# EAGLE design NCU_PCB_Rev2 (EAGLE 9.6.2)

## Sheet 1 of 4
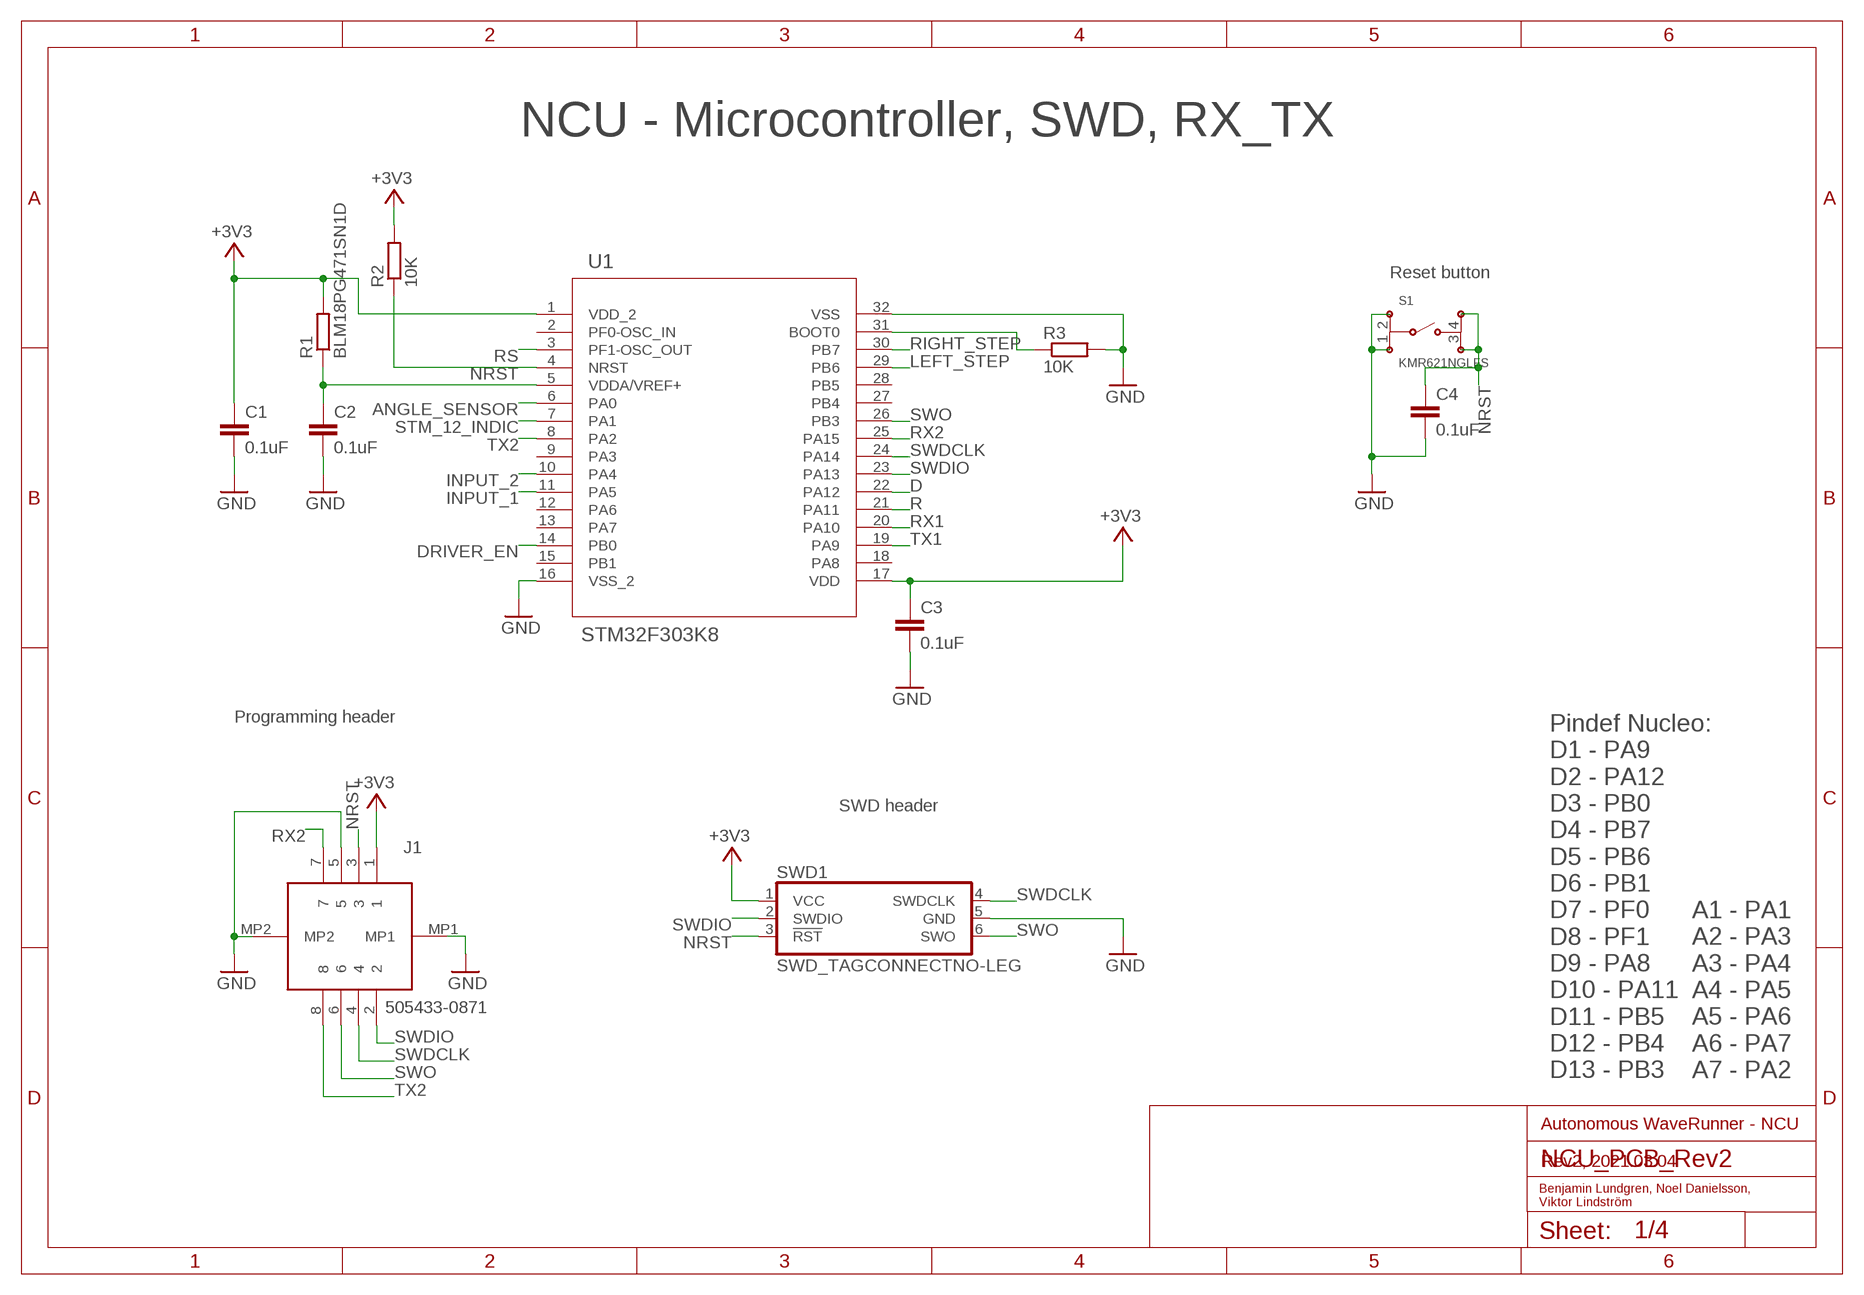
[diagram p0: schematic, sheet 1]

### Parts
C1  0.1uF  C0603  [C0603]
C2  0.1uF  C0603  [C0603]
C3  0.1uF  C0603  [C0603]
C4  0.1uF  C0603  [C0603]
J1  505433-0871  [5054330871]
R1  BLM18PG471SN1D  R0603  [R0603]
R2  10K  R0603  [R0603]
R3  10K  R0603  [R0603]
S1  KMR621NGLFS  [KMR621NGLFS]
SWD1  SWD_TAGCONNECTNO-LEG  [TC2030-IDC-NL]
U1  STM32F303K8  [LQFP-32]

### Nets
+3V3: C1.1 C3.1 J1.1 R1.2 R2.2 SWD1.1(VCC) U1.1(VDD_2) U1.17(VDD) ; also sheet 2,3,4
ANGLE_SENSOR: U1.6(PA0) ; also sheet 3
D: U1.22(PA12) ; also sheet 4
DRIVER_EN: U1.14(PB0) ; also sheet 3
GND: C1.2 C2.2 C3.2 C4.2 J1.5 J1.MP1 J1.MP2 R3.2 S1.1 S1.2 SWD1.5(GND) U1.16(VSS_2) U1.32(VSS) ; also sheet 2,3,4
INPUT_1: U1.11(PA5) ; also sheet 3
INPUT_2: U1.10(PA4) ; also sheet 3
LEFT_STEP: U1.29(PB6) ; also sheet 3
N$26: C2.1 R1.1 U1.5(VDDA/VREF+)
N$27: R3.1 U1.31(BOOT0)
NRST: C4.1 J1.3 R2.1 S1.3 S1.4 SWD1.3(!RST) U1.4(NRST)
R: U1.21(PA11) ; also sheet 4
RIGHT_STEP: U1.30(PB7) ; also sheet 3
RS: U1.3(PF1-OSC_OUT) ; also sheet 4
RX1: U1.20(PA10) ; also sheet 3
RX2: J1.7 U1.25(PA15)
STM_12_INDIC: U1.7(PA1) ; also sheet 2
SWDCLK: J1.4 SWD1.4(SWDCLK) U1.24(PA14)
SWDIO: J1.2 SWD1.2(SWDIO) U1.23(PA13)
SWO: J1.6 SWD1.6(SWO) U1.26(PB3)
TX1: U1.19(PA9) ; also sheet 3
TX2: J1.8 U1.8(PA2)
Unconnected: U1.2(PF0-OSC_IN) U1.9(PA3) U1.12(PA6) U1.13(PA7) U1.15(PB1) U1.18(PA8) U1.27(PB4) U1.28(PB5)

### Notes on the sheet
- NCU - Microcontroller, SWD, RX_TX
- Reset button
- Programming header
- SWD header
- Pindef Nucleo:
  D1 - PA9
  D2 - PA12
  D3 - PB0
  D4 - PB7
  D5 - PB6
  D6 - PB1
  D7 - PF0
  D8 - PF1
  D9 - PA8
  D10 - PA11
  D11 - PB5
  D12 - PB4
  D13 - PB3
- A1 - PA1
  A2 - PA3
  A3 - PA4
  A4 - PA5
  A5 - PA6
  A6 - PA7
  A7 - PA2
- Autonomous WaveRunner - NCU
- Rev2, 2021.03.04
- Benjamin Lundgren, Noel Danielsson, 
  Viktor Lindström

## Sheet 2 of 4
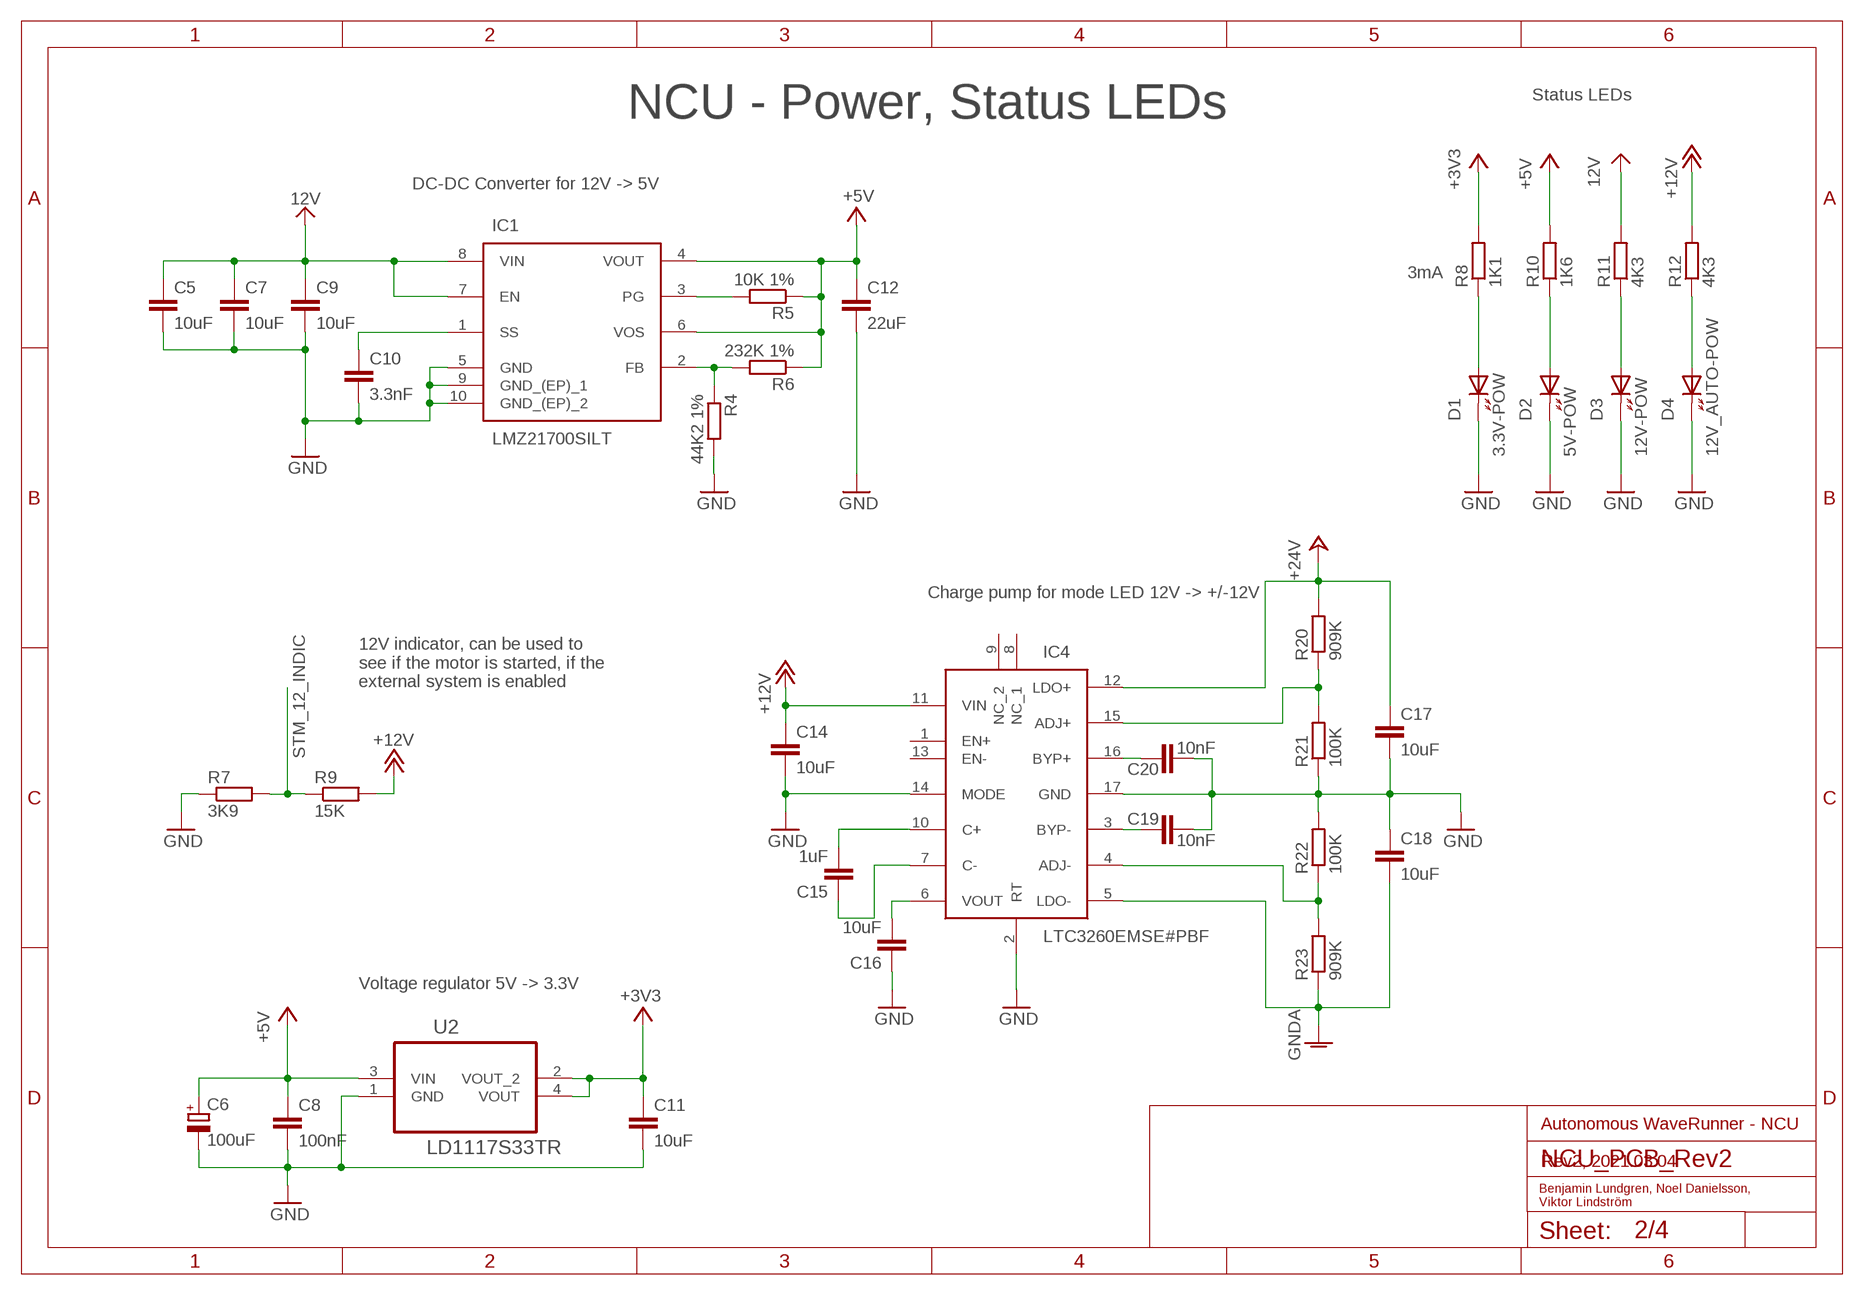
[diagram p1: schematic, sheet 2]

### Parts
C5  10uF  C1206  [C1206]
C6  100uF  PANASONIC_C  [PANASONIC_C]
C7  10uF  C1206  [C1206]
C8  100nF  C0603  [C0603]
C9  10uF  C1206  [C1206]
C10  3.3nF  C0603  [C0603]
C11  10uF  C0805  [C0805]
C12  22uF  C0805  [C0805]
C14  10uF  C1206  [C1206]
C15  1uF  C0805  [C0805]
C16  10uF  C1206  [C1206]
C17  10uF  C1206  [C1206]
C18  10uF  C1206  [C1206]
C19  10nF  C0603  [C0603]
C20  10nF  C0603  [C0603]
D1  3.3V-POW  CHIP-LED0805  [CHIP-LED0805]
D2  5V-POW  CHIP-LED0805  [CHIP-LED0805]
D3  12V-POW  CHIP-LED0805  [CHIP-LED0805]
D4  12V_AUTO-POW  CHIP-LED0805  [CHIP-LED0805]
IC1  LMZ21700SILT  [SIL0008E]
IC4  LTC3260EMSE#PBF  [SOP50P490X110-17N]
R4  44K2 1%  R0603  [R0603]
R5  10K 1%  R0603  [R0603]
R6  232K 1%  R0603  [R0603]
R7  3K9  R0603  [R0603]
R8  1K1  R0603  [R0603]
R9  15K  R0603  [R0603]
R10  1K6  R0603  [R0603]
R11  4K3  R0603  [R0603]
R12  4K3  R0603  [R0603]
R20  909K  R0603  [R0603]
R21  100K  R0603  [R0603]
R22  100K  R0603  [R0603]
R23  909K  R0603  [R0603]
U2  LD1117S33TR  [SOT230P700X180-4N]

### Nets
12V: C5.1 C7.1 C9.1 IC1.7(EN) IC1.8(VIN) R11.2 ; also sheet 3,4
+3V3: C11.1 R8.2 U2.2(VOUT_2) U2.4(VOUT) ; also sheet 1,3,4
+5V: C6.+ C8.1 C12.1 IC1.4(VOUT) IC1.6(VOS) R5.1 R6.1 R10.2 U2.3(VIN) ; also sheet 3
+12V: C14.1 IC4.11(VIN) R9.2 R12.2 ; also sheet 3,4
+24V: C17.1 IC4.12(LDO+) R20.2 ; also sheet 3
GND: C5.2 C6.- C7.2 C8.2 C9.2 C10.2 C11.2 C12.2 C14.2 C16.1 C17.2 C18.1 C19.2 C20.2 D1.C(K) D2.C(K) D3.C(K) D4.C(K) IC1.5(GND) IC1.9(GND_(EP)_1) IC1.10(GND_(EP)_2) IC4.2(RT) IC4.14(MODE) IC4.17(GND) R4.2 R7.1 R21.1 R22.2 U2.1(GND) ; also sheet 1,3,4
GNDA: C18.2 IC4.5(LDO-) R23.1 ; also sheet 3
N$4: D4.A R12.1
N$5: IC1.2(FB) R4.1 R6.2
N$6: C10.1 IC1.1(SS)
N$7: C15.2 IC4.10(C+)
N$8: C15.1 IC4.7(C-)
N$9: C20.1 IC4.16(BYP+)
N$10: D3.A R11.1
N$11: IC1.3(PG) R5.2
N$12: C19.1 IC4.3(BYP-)
N$13: C16.2 IC4.6(VOUT)
N$14: IC4.15(ADJ+) R20.1 R21.2
N$16: IC4.4(ADJ-) R22.1 R23.2
N$17: D2.A R10.1
N$42: D1.A R8.1
STM_12_INDIC: R7.2 R9.1 ; also sheet 1
Unconnected: IC4.1(EN+) IC4.8(NC_1) IC4.9(NC_2) IC4.13(EN-)

### Notes on the sheet
- NCU - Power, Status LEDs | Status LEDs
- DC-DC Converter for 12V -> 5V
- 3mA
- Charge pump for mode LED 12V -> +/-12V
- 12V indicator, can be used to
  see if the motor is started, if the 
  external system is enabled
- Voltage regulator 5V -> 3.3V
- Autonomous WaveRunner - NCU
- Rev2, 2021.03.04
- Benjamin Lundgren, Noel Danielsson, 
  Viktor Lindström

## Sheet 3 of 4
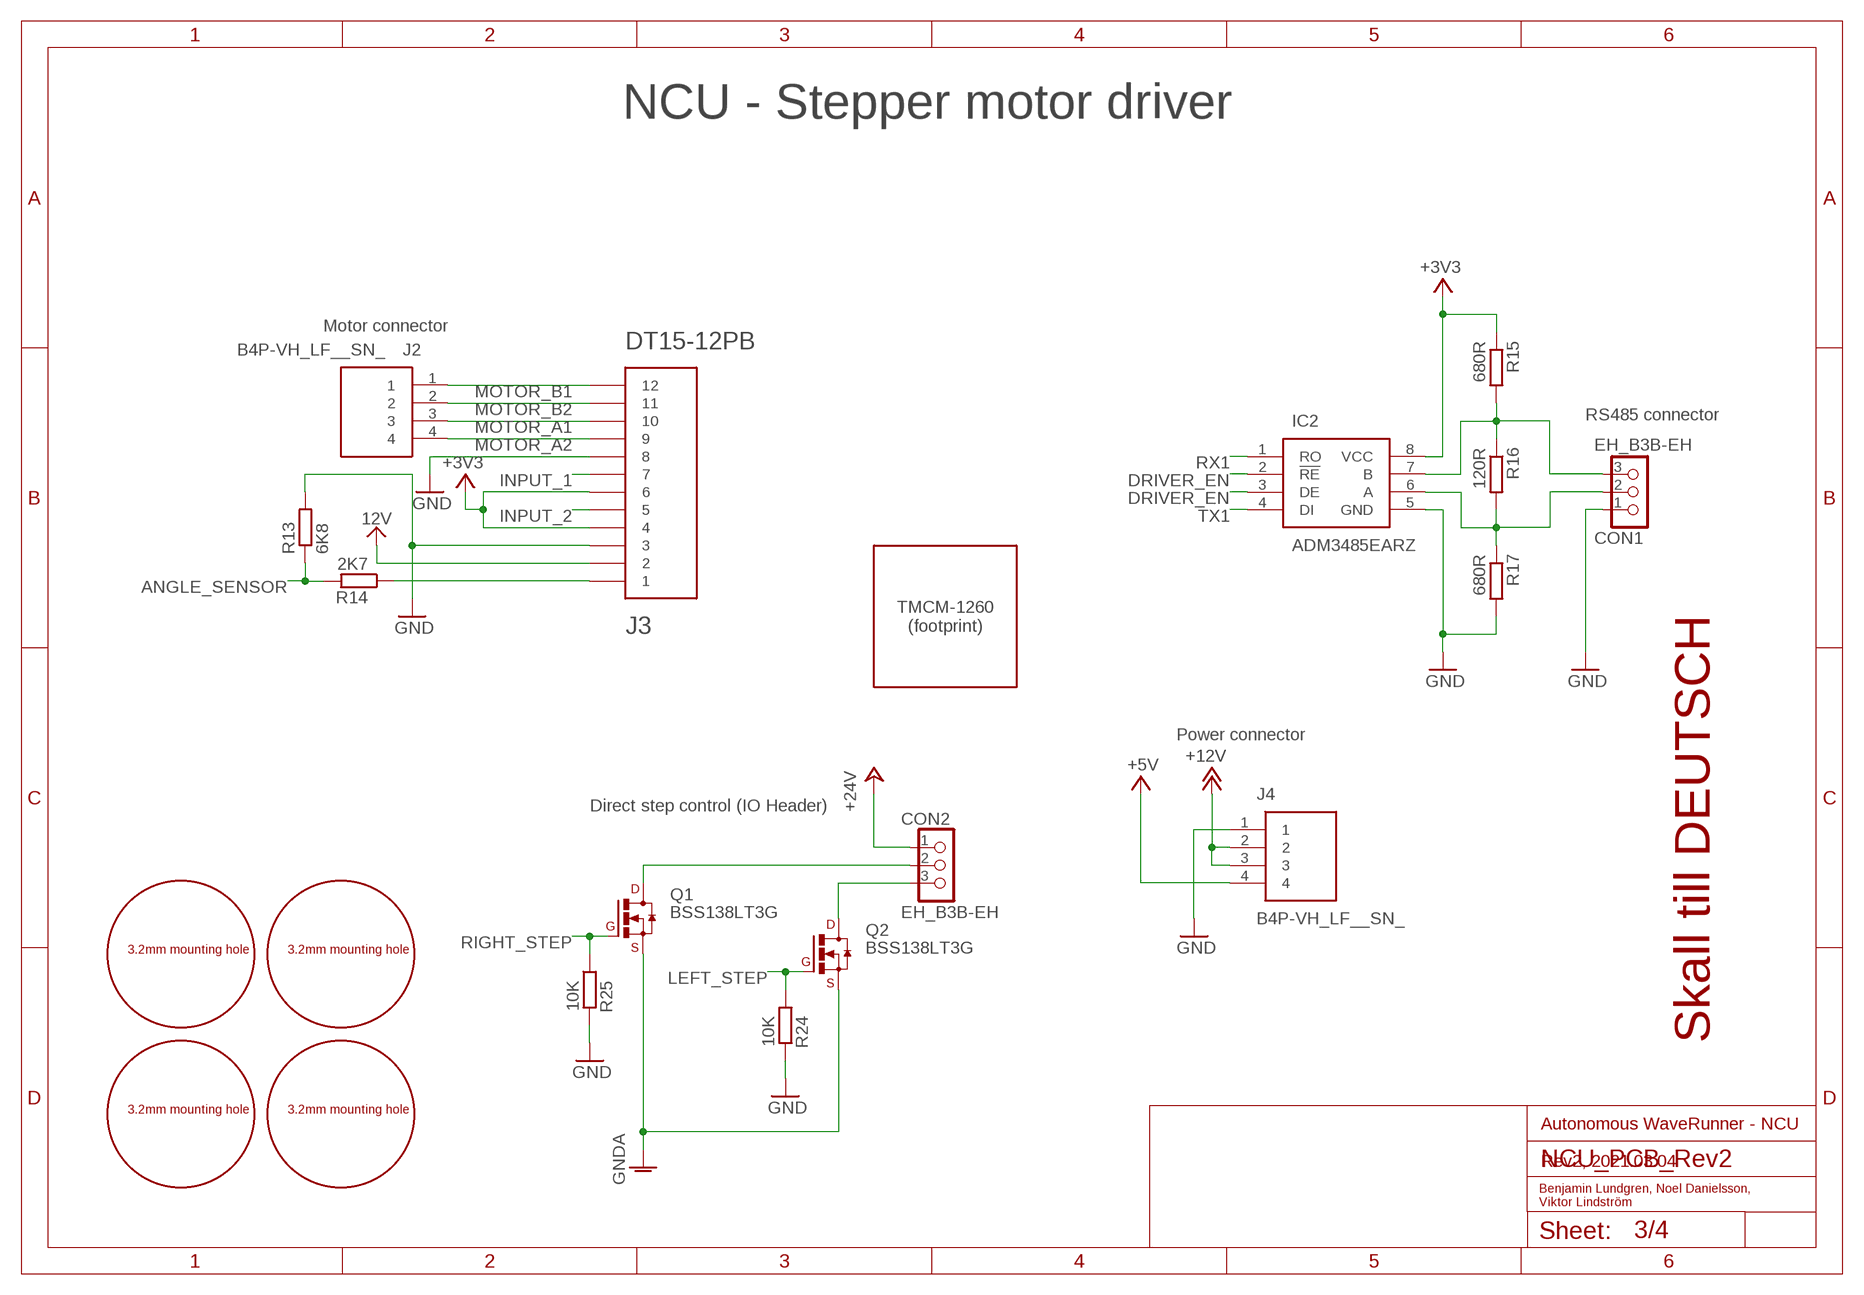
[diagram p2: schematic, sheet 3]

### Parts
CON1  EH_B3B-EH  [B3B-EH]
CON2  EH_B3B-EH  [B3B-EH]
HOLE1  M3_MOUNTING_HOLE  [M3_MOUNTING_HOLE]
HOLE2  M3_MOUNTING_HOLE  [M3_MOUNTING_HOLE]
HOLE3  M3_MOUNTING_HOLE  [M3_MOUNTING_HOLE]
HOLE4  M3_MOUNTING_HOLE  [M3_MOUNTING_HOLE]
IC2  ADM3485EARZ  [SOIC127P600X175-8N]
J2  B4P-VH_LF__SN_  [SHDR4W114P0X396_1X4_1578X850X9]
J3  DT15-12PB  [TE_DT15-12PB]
J4  B4P-VH_LF__SN_  [SHDR4W114P0X396_1X4_1578X850X9]
MOD1  TMCM-1260  [TMCM_1260]
Q1  BSS138LT3G  [SOT23]
Q2  BSS138LT3G  [SOT23]
R13  6K8  R0603  [R0603]
R14  2K7  R0603  [R0603]
R15  680R  R0603  [R0603]
R16  120R  R0603  [R0603]
R17  680R  R0603  [R0603]
R24  10K  R0603  [R0603]
R25  10K  R0603  [R0603]

### Nets
12V: J3.2 ; also sheet 2,4
+3V3: IC2.8(VCC) J3.4 J3.6 R15.1 ; also sheet 1,2,4
+5V: J4.4 ; also sheet 2
+12V: J4.2 J4.3 ; also sheet 2,4
+24V: CON2.1 ; also sheet 2
ANGLE_SENSOR: R13.1 R14.2 ; also sheet 1
DRIVER_EN: IC2.2(!RE) IC2.3(DE) ; also sheet 1
GND: CON1.1 IC2.5(GND) J3.3 J3.8 J4.1 R13.2 R17.2 R24.2 R25.2 ; also sheet 1,2,4
GNDA: Q1.2(S) Q2.2(S) ; also sheet 2
INPUT_1: J3.7 ; also sheet 1
INPUT_2: J3.5 ; also sheet 1
LEFT_STEP: Q2.1(G) R24.1 ; also sheet 1
MOTOR_A1: J2.3 J3.10
MOTOR_A2: J2.4 J3.9
MOTOR_B1: J2.1 J3.12
MOTOR_B2: J2.2 J3.11
N$1: CON1.3 IC2.7(B) R15.2 R16.1
N$2: J3.1 R14.1
N$3: CON1.2 IC2.6(A) R16.2 R17.1
N$18: CON2.2 Q1.3(D)
N$19: CON2.3 Q2.3(D)
RIGHT_STEP: Q1.1(G) R25.1 ; also sheet 1
RX1: IC2.1(RO) ; also sheet 1
TX1: IC2.4(DI) ; also sheet 1

### Notes on the sheet
- NCU - Stepper motor driver
- Motor connector
- RS485 connector
- Power connector
- Direct step control (IO Header)
- Skall till DEUTSCH
- Autonomous WaveRunner - NCU
- Rev2, 2021.03.04
- Benjamin Lundgren, Noel Danielsson, 
  Viktor Lindström

## Sheet 4 of 4
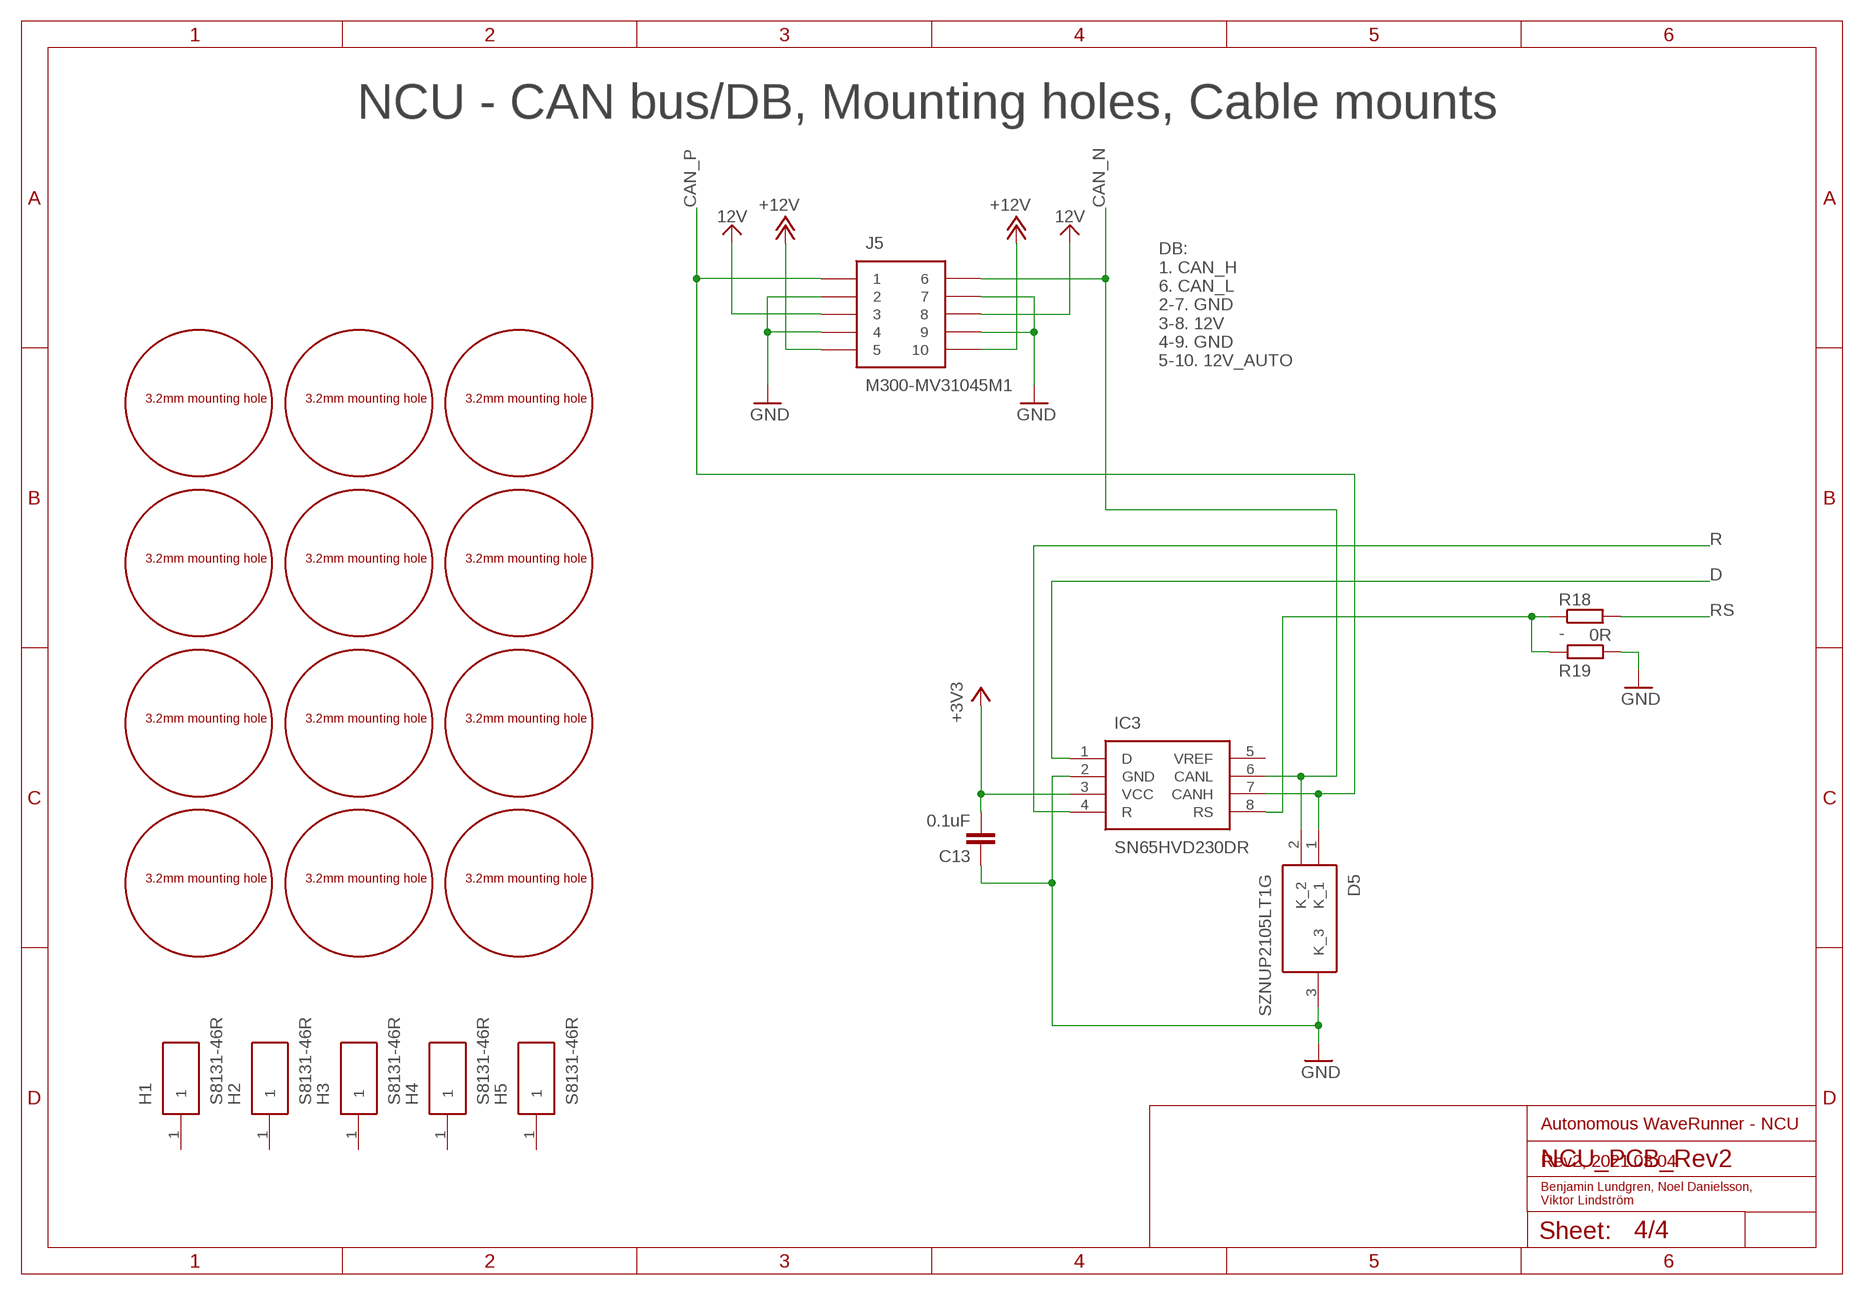
[diagram p3: schematic, sheet 4]

### Parts
C13  0.1uF  C0603  [C0603]
D5  SZNUP2105LT1G  [SOT96P237X111-3N]
H1  S8131-46R  [S813146R]
H2  S8131-46R  [S813146R]
H3  S8131-46R  [S813146R]
H4  S8131-46R  [S813146R]
H5  S8131-46R  [S813146R]
HOLE5  M3_MOUNTING_HOLE  [M3_MOUNTING_HOLE]
HOLE6  M3_MOUNTING_HOLE  [M3_MOUNTING_HOLE]
HOLE7  M3_MOUNTING_HOLE  [M3_MOUNTING_HOLE]
HOLE8  M3_MOUNTING_HOLE  [M3_MOUNTING_HOLE]
HOLE9  M3_MOUNTING_HOLE  [M3_MOUNTING_HOLE]
HOLE10  M3_MOUNTING_HOLE  [M3_MOUNTING_HOLE]
HOLE11  M3_MOUNTING_HOLE  [M3_MOUNTING_HOLE]
HOLE12  M3_MOUNTING_HOLE  [M3_MOUNTING_HOLE]
HOLE13  M3_MOUNTING_HOLE  [M3_MOUNTING_HOLE]
HOLE14  M3_MOUNTING_HOLE  [M3_MOUNTING_HOLE]
HOLE15  M3_MOUNTING_HOLE  [M3_MOUNTING_HOLE]
HOLE16  M3_MOUNTING_HOLE  [M3_MOUNTING_HOLE]
IC3  SN65HVD230DR  [SOT127P600X175-8N]
J5  M300-MV31045M1  [M300MV31045M1]
R18  -  R0603  [R0603]
R19  0R  R0603  [R0603]

### Nets
12V: J5.3 J5.8 ; also sheet 2,3
+3V3: C13.2 IC3.3(VCC) ; also sheet 1,2,3
+12V: J5.5 J5.10 ; also sheet 2,3
CAN_N: D5.2(K_2) IC3.6(CANL) J5.6
CAN_P: D5.1(K_1) IC3.7(CANH) J5.1
D: IC3.1(D) ; also sheet 1
GND: C13.1 D5.3(K_3) IC3.2(GND) J5.2 J5.4 J5.7 J5.9 R19.1 ; also sheet 1,2,3
N$15: IC3.8(RS) R18.1 R19.2
R: IC3.4(R) ; also sheet 1
RS: R18.2 ; also sheet 1
Unconnected: H1.1 H2.1 H3.1 H4.1 H5.1 IC3.5(VREF)

### Notes on the sheet
- NCU - CAN bus/DB, Mounting holes, Cable mounts
- DB:
  1. CAN_H
  6. CAN_L
  2-7. GND
  3-8. 12V
  4-9. GND
  5-10. 12V_AUTO
- Autonomous WaveRunner - NCU
- Rev2, 2021.03.04
- Benjamin Lundgren, Noel Danielsson, 
  Viktor Lindström

## Library data of the parts
C1-C4 C8 C10 C13 C19 C20 = CASE-RCL:C0603: Standard Chip CAPACITOR 0605 (1608 Metric) Description: Standard Chip CAPACITOR 0605 (1608 Metric)
C5 C7 C9 C14 C16-C18 = CASE-RCL:C1206: Standard Chip CAPACITOR 1206 (3216 Metric) Description: Standard Chip CAPACITOR 1206 (3216 Metric)
C6 = CASE-RCL:PANASONIC_C: Panasonic VS Type Aluminum Electrolytic SMD Capacitors Size C - (TEAPO D5) Description: Size C of VS type SMD capacitor from Panasonic. Diameter of cap = 5mm. (TEAPO D5) Links: TEAPO1 <http://www.farnell.com/datasheets/2622415.pdf?_ga=2.91453018.1951585514.1537363662-1535130828.1530438260> TEAPO2 <http://www.teapo.com.tw/WebSiteFile/Products/Product_Data/EV%20%20SPEC.pdf> PANASONIC <https://industrial.panasonic.com/cdbs/www-data/pdf/RDE0000/DME0000COL92.pdf>
C11 C12 C15 = CASE-RCL:C0805: Standard Chip CAPACITOR 0805 (2012 Metric) Description: Standard Chip CAPACITOR 0805 (2012 Metric)
CON1 CON2 = CASE-JST:EH_B3B-EH: JST EH Connector, through hole, 3 pin, top entry Description: JST EH connector with 2.5 mm pitch, through hole version, 3 pin, top entry. Links: Datasheet <http://www.jst-mfg.com/product/pdf/eng/eEH.pdf>
D1-D4 = CASE-LED:CHIP-LED0805: CHIP-LED0805 (SMD) Description: Standard 0805 SMD CHIP-LED
D5 = RescueRunner:SZNUP2105LT1G: Dual Bi-Directional TVS Diode, 350W peak, 3-pin SOT-23 Source: Datasheet <https://componentsearchengine.com/Datasheets/1/SZNUP2105LT1G.pdf>; DESCRIPTION: Dual Bi-Directional TVS Diode, 350W peak, 3-pin SOT-23; HEIGHT: 1.11mm; MANUFACTURER_NAME: ON Semiconductor; MANUFACTURER_PART_NUMBER: SZNUP2105LT1G; MOUSER_PART_NUMBER: 863-SZNUP2105LT1G; MOUSER_PRICE-STOCK: https://www.mouser.com/Search/Refine.aspx?Keyword=863-SZNUP2105LT1G
H1-H5 = RescueRunner:S8131-46R: HARWIN - S8131-46R - Fastener, Low Profile PCB, Surface Mount Cable Clamp, 1.8 mm, Copper, Grey, 10 mm, 8 mm Source: Datasheet <http://uk.rs-online.com/web/p/products/7884842P>; DESCRIPTION: HARWIN - S8131-46R - Fastener, Low Profile PCB, Surface Mount Cable Clamp, 1.8 mm, Copper, Grey, 10 mm, 8 mm; HEIGHT: 3.7mm; MANUFACTURER_NAME: HARWIN; MANUFACTURER_PART_NUMBER: S8131-46R; RS_PART_NUMBER: 7884842P; RS_PRICE-STOCK: http://uk.rs-online.com/web/p/products/7884842P
HOLE1-HOLE16 = RescueRunner:M3_MOUNTING_HOLE
IC1 = RescueRunner:LMZ21700SILT: 3V to 17V, 0.65A Step-Down DC/DC Power Module in 3.5mm 3.5mm Package Source: Datasheet <http://uk.rs-online.com/web/p/products/9009750P>; DESCRIPTION: 3V to 17V, 0.65A Step-Down DC/DC Power Module in 3.5mm 3.5mm Package; HEIGHT: mm; MANUFACTURER_NAME: Texas Instruments; MANUFACTURER_PART_NUMBER: LMZ21700SILT; RS_PART_NUMBER: 9009750P; RS_PRICE-STOCK: http://uk.rs-online.com/web/p/products/9009750P
IC2 = RescueRunner:ADM3485EARZ: +/-15 kV ESD-Protected, 3.3 V,12 Mbps,EIA RS-485/RS-422 Transceiver Source: Datasheet <http://uk.rs-online.com/web/p/products/0412709P>; DESCRIPTION: +/-15 kV ESD-Protected, 3.3 V,12 Mbps,EIA RS-485/RS-422 Transceiver; HEIGHT: 1.75mm; MANUFACTURER_NAME: Analog Devices; MANUFACTURER_PART_NUMBER: ADM3485EARZ; RS_PART_NUMBER: 0412709P; RS_PRICE-STOCK: http://uk.rs-online.com/web/p/products/0412709P
IC3 = RescueRunner:SN65HVD230DR: 3.3 V CAN Transceiver with Standby Mode Source: Datasheet <http://www.ti.com/lit/gpn/sn65hvd230>; DESCRIPTION: 3.3 V CAN Transceiver with Standby Mode; HEIGHT: 1.75mm; MANUFACTURER_NAME: Texas Instruments; MANUFACTURER_PART_NUMBER: SN65HVD230DR; MOUSER_PART_NUMBER: 595-SN65HVD230DR; MOUSER_PRICE-STOCK: https://www.mouser.com/Search/Refine.aspx?Keyword=595-SN65HVD230DR
IC4 = RescueRunner:LTC3260EMSE#PBF: LTC3260,Charge Pump Inverter,MSOP EP-16 Linear Technology LTC3260EMSE#PBF, Charge Pump Inverting 100mA 550 kHz, -4.5 -32 V, 16-Pin, MSOP Source: Datasheet <http://uk.rs-online.com/web/p/products/8516768P>; DESCRIPTION: LTC3260,Charge Pump Inverter,MSOP EP-16 Linear Technology LTC3260EMSE#PBF, Charge Pump Inverting 100mA 550 kHz, -4.5 -32 V, 16-Pin, MSOP; HEIGHT: 1.1mm; MANUFACTURER_NAME: Linear Technology; MANUFACTURER_PART_NUMBER: LTC3260EMSE#PBF; RS_PART_NUMBER: 8516768P; RS_PRICE-STOCK: http://uk.rs-online.com/web/p/products/8516768P
J1 = RescueRunner:505433-0871: CONN HEADER SMD 8POS 1.25MM Source: Datasheet <https://www.molex.com/pdm_docs/sd/5054330871_sd.pdf>; DESCRIPTION: CONN HEADER SMD 8POS 1.25MM; HEIGHT: 7.25mm; MANUFACTURER_NAME: Molex; MANUFACTURER_PART_NUMBER: 5054330871
J2 J4 = RescueRunner:B4P-VH_LF__SN_: connector,multipole PCB use,B4P-VH,VH se JST VH Series, 3.96mm Pitch 4 Way 1 Row Straight PCB Header, Solder Termination, 10A Source: Datasheet <http://uk.rs-online.com/web/p/products/8201157P>; DESCRIPTION: connector,multipole PCB use,B4P-VH,VH se JST VH Series, 3.96mm Pitch 4 Way 1 Row Straight PCB Header, Solder Termination, 10A; HEIGHT: 9.4mm; MANUFACTURER_NAME: JST (JAPAN SOLDERLESS TERMINALS); MANUFACTURER_PART_NUMBER: B4P-VH(LF)(SN); RS_PART_NUMBER: 8201157P; RS_PRICE-STOCK: http://uk.rs-online.com/web/p/products/8201157P
J3 = RescueRunner:DT15-12PB: DEUTSCH Automotive; DT RECP ASM; AVAILABILITY: Not in stock; DESCRIPTION: DEUTSCH Automotive; DT RECP ASM; MF: TE Connectivity; MPN: DT15-12PB; PARTREV: C3; STANDARD: Manufacturer recommendation
J5 = RescueRunner:M300-MV31045M1: Headers & Wire Housings 10 WAY MALE PC TAIL DIL WJS Source: Datasheet <https://componentsearchengine.com/Datasheets/1/M300-MV31045M1.pdf>; DESCRIPTION: Headers & Wire Housings 10 WAY MALE PC TAIL DIL WJS; HEIGHT: 7.05mm; MANUFACTURER_NAME: HARWIN; MANUFACTURER_PART_NUMBER: M300-MV31045M1
MOD1 = RescueRunner:TMCM-1260
Q1 Q2 = CASE-Transistors:BSS138LT3G: BSS138LT3G N-Channel Mosfet (SOT-23) Description: BSS138LT3G N-Channel Mosfet in a SOT-23 package Links: BSS138LT3G <http://www.farnell.com/datasheets/2353875.pdf?_ga=2.38865383.510093211.1546607516-411290609.1543318711>
R1-R25 = CASE-RCL:R0603: Standard Chip RESISTOR 0603 (1608 Metric) Description: Standard Chip RESISTOR 0603 (1608 Metric)
S1 = CASE-Switches:KMR621NGLFS: C&K KMR621NG LFS Tactile SPST switch (SMD) Description: C&K KMR621NG LFS Tactile SPST switch SMD package. Links: KMR621NG LFS <http://www.farnell.com/datasheets/2706242.pdf?_ga=2.40597409.2071720333.1546461288-1112771566.1525371275>
SWD1 = CASE-Prog_Header:SWD_TAGCONNECT: SWD Programming header (Tag-Connect version) Description: SWD Programming header for Tag Connect TC2030-IDC, both legged and no-legged version Links: Tag-Connect <http://www.tag-connect.com/JLINK>
U1 = CASE-MCU:STM32F303K8: STM32F303K8, LQFP-32 Description: STM32F303K8 from STMicroelectronics F3 series (Arm Cortex M4), LQFP-32 package Links: Datasheet <https://www.st.com/resource/en/datasheet/stm32f303k8.pdf> Website <https://www.st.com/en/microcontrollers/stm32f303k8.html> NUCLEO-F303K8 <https://www.st.com/en/evaluation-tools/nucleo-f303k8.html>; MANUFACTURER_PART_NUMBER: stm32f303_334kxt; VENDOR: STMicroelectronics
U2 = CASE-Voltage_regulators:LD1117S33TR: LD1117S33TR, 3.3V LDO voltage regulator, SOT-223-4 Description: LD1117S33TR, 3.3V LDO voltage regulator in SOT-223-3 package - Input voltage: 4.75-15V - Output voltage: 3.3V - Output current: 800mA - Dropout voltage: 1.1V Links: Datasheet <http://www.farnell.com/datasheets/1776449.pdf?_ga=2.71508627.1869469127.1547838600-114062766.1547494298>; MPN: LD1117S33TR; OC_FARNELL: 2253484; OC_NEWARK: 89K0627; PACKAGE: SOT223-3; SUPPLIER: STMicroelectronics

## Net classes
0 default: width 0.2 mm
1 motor_power: width 3.5 mm, drill 0.076 mm

## Board
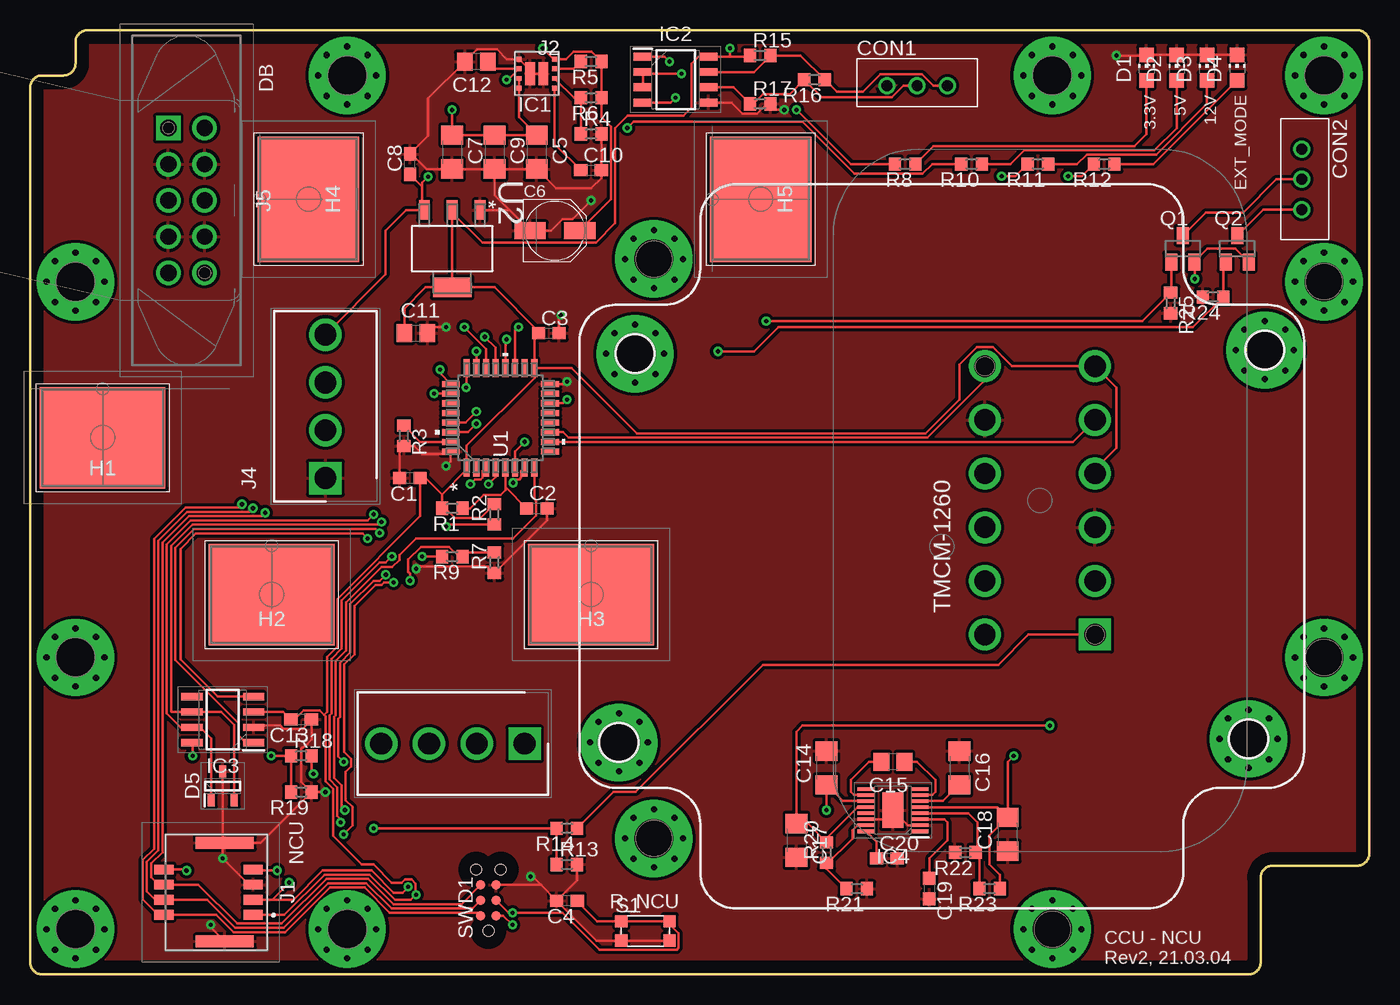
[diagram p4: board, top side]
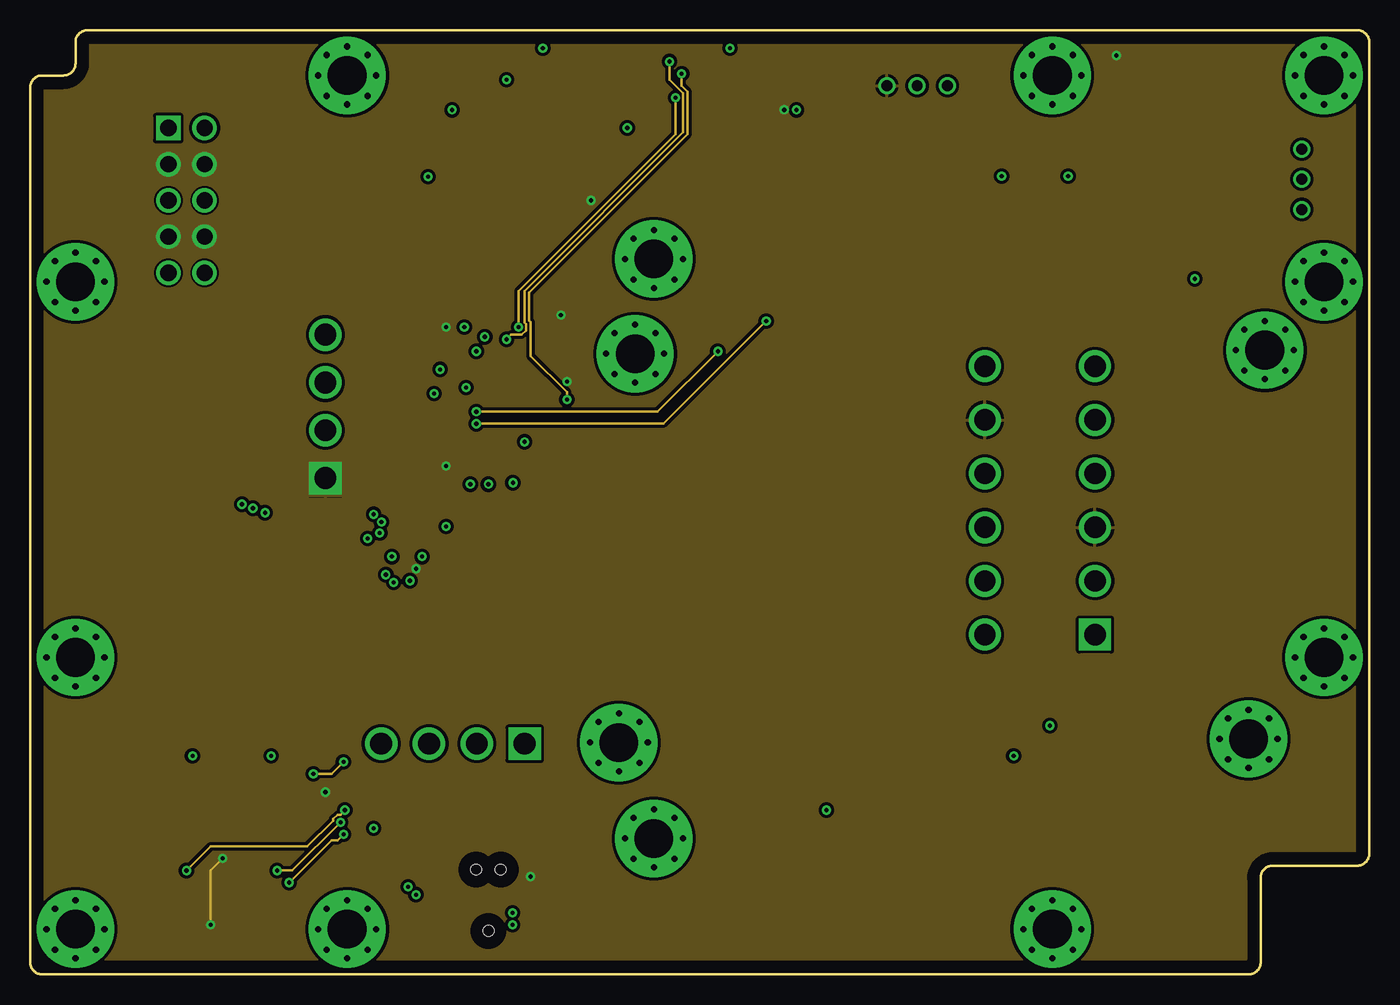
[diagram p5: board, inner layer Route2]
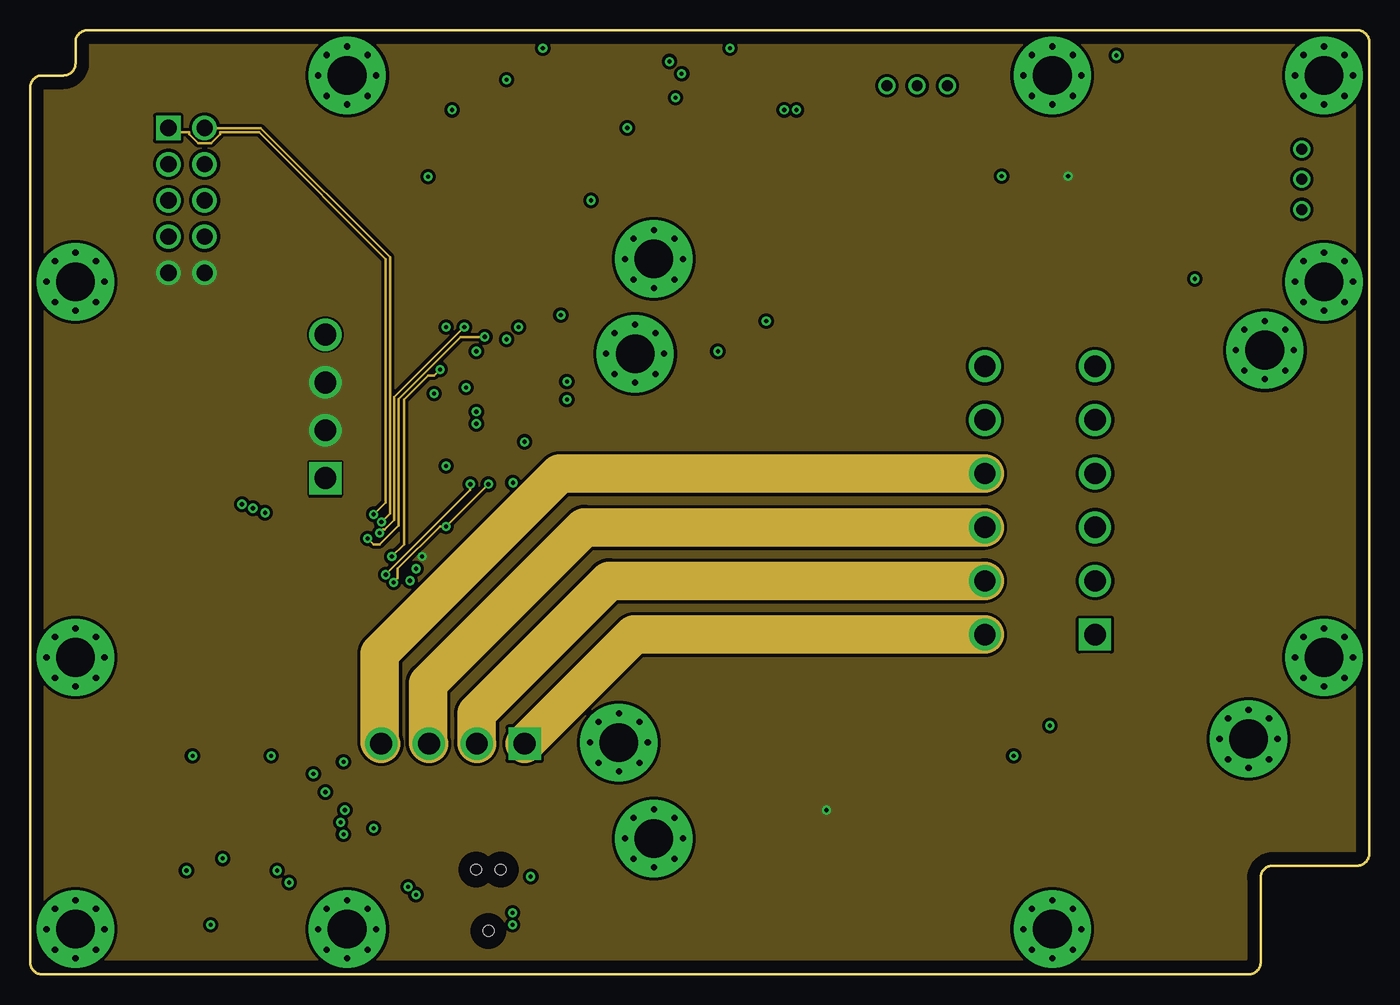
[diagram p6: board, inner layer Route15]
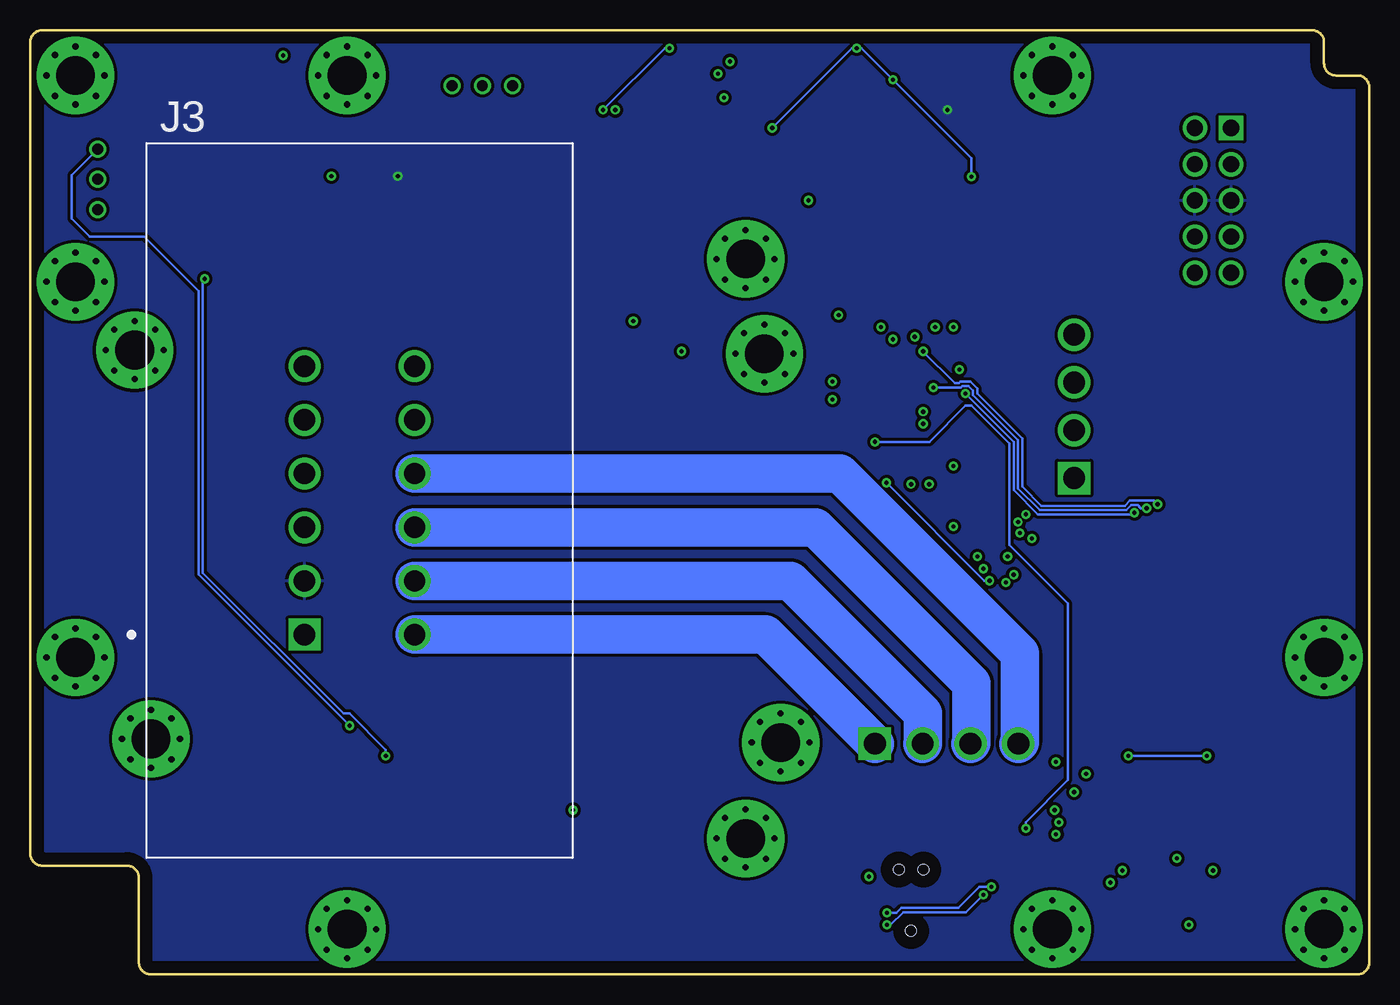
[diagram p7: board, bottom side, seen from below]

Size 110.89 x 78.2 mm. Coordinates in mm from the lower left corner, seen from the top.
Outline: 4.75,78.2 109.89,78.2 arc-90 110.89,77.2 110.89,10 arc-90 109.89,9 102.89,9 arc90 101.89,8 101.89,1 arc-90 100.89,0 1,0 arc-90 0,1 0,73.45 arc-90 1,74.45 2.75,74.45 arc90 3.75,75.45 3.75,77.2 arc-90 4.75,78.2
Copper layers (1+2*15+16): Top 0.043mm / dielectric 0.1248mm / Route2 0.035mm / dielectric 1.2mm / Route15 0.035mm / dielectric 0.1248mm / Bottom 0.043mm
Design rules "default *": minimum track width 6mil, minimum drill 0.35mm, track to track 6mil, track to pad 6mil, pad to pad 6mil, via to via 6mil, smd to smd 6mil, copper to edge 40mil, drill to drill 6mil, minimum pad ring 10mil, minimum via ring 8mil, stop-mask expansion 4mil, vias tented up to drill 0mil, thermal gap 10mil

### Footprints (pad centres in the part's own frame; a part is rotated, then mirrored left to right if it is on the bottom)
C0603 = smd 1.1 x 1: 1 -0.85,0; 2 0.85,0
C1206 = smd 1.6 x 1.8: 1 -1.4,0; 2 1.4,0
PANASONIC_C = smd 2.6 x 1.4: + 2.05,0; - -2.05,0
C0805 = smd 1.3 x 1.5: 1 -0.95,0; 2 0.95,0
B3B-EH = drill 0.9: 1 -2.5,0; 2 0,0; 3 2.5,0
CHIP-LED0805 = smd 1.2 x 1.2: A 0,-1.05; C 0,1.05
SOT96P237X111-3N = smd 1 x 0.6: 1 -1.2,0.955; 2 -1.2,-0.955; 3 1.2,0
S813146R = smd 10.4 x 8.4: 1 0,0
M3_MOUNTING_HOLE = drill 0.5 pad 0.8: P$1 -2.4,0; P$2 0,2.4; P$3 2.4,0; P$4 0,-2.4; P$5 -1.697,1.697; P$6 1.697,1.697; P$7 1.697,-1.697; P$8 -1.697,-1.697 | drill 3.2 pad 6.4: P$10 0,0
SIL0008E = smd 0.45 x 0.4: 1 -1.475,1.2; 2 -1.475,0.4; 3 -1.475,-0.4; 4 -1.475,-1.2; 5 1.475,-1.2; 6 1.475,-0.4; 7 1.475,0.4; 8 1.475,1.2 | smd 0.8 x 1.9: 9 0.55,0; 10 -0.55,0
SOIC127P600X175-8N = smd 1.525 x 0.65: 1 -2.712,1.905; 2 -2.712,0.635; 3 -2.712,-0.635; 4 -2.712,-1.905; 5 2.712,-1.905; 6 2.712,-0.635; 7 2.712,0.635; 8 2.712,1.905
SOT127P600X175-8N = smd 1.75 x 0.6: 1 -2.55,1.905; 2 -2.55,0.635; 3 -2.55,-0.635; 4 -2.55,-1.905; 5 2.55,-1.905; 6 2.55,-0.635; 7 2.55,0.635; 8 2.55,1.905
SOP50P490X110-17N = smd 1.425 x 0.3: 1 -2.212,1.75; 2 -2.212,1.25; 3 -2.212,0.75; 4 -2.212,0.25; 5 -2.212,-0.25; 6 -2.212,-0.75; 7 -2.212,-1.25; 8 -2.212,-1.75; 9 2.212,-1.75; 10 2.212,-1.25; 11 2.212,-0.75; 12 2.212,-0.25; 13 2.212,0.25; 14 2.212,0.75; 15 2.212,1.25; 16 2.212,1.75 | smd 1.753 x 2.947: 17 0,0
5054330871 = smd 0.8 x 1.6: 1 1.875,3.517; 2 1.875,-3.873; 3 0.625,3.517; 4 0.625,-3.873; 5 -0.625,3.517; 6 -0.625,-3.873; 7 -1.875,3.517; 8 -1.875,-3.873 | smd 1 x 4.8: MP1 4.075,1.177; MP2 -4.075,1.177
SHDR4W114P0X396_1X4_1578X850X9 = drill 1.8 pad 2.7 square: 1 0,0 | drill 1.8 pad 2.7: 2 3.96,0; 3 7.92,0; 4 11.88,0
TE_DT15-12PB = drill 1.77 square: 1 -4.56,-11.115 | drill 1.77: 2 -4.56,-6.67; 3 -4.56,-2.225; 4 -4.56,2.225; 5 -4.56,6.67; 6 -4.56,11.115; 7 4.56,11.115; 8 4.56,6.67; 9 4.56,2.225; 10 4.56,-2.225; 11 4.56,-6.67; 12 4.56,-11.115
M300MV31045M1 = drill 1.35 pad 2.025 square: 1 0,0 | drill 1.35 pad 2.025: 2 3,0; 3 6,0; 4 9,0; 5 12,0; 6 0,3; 7 3,3; 8 6,3; 9 9,3; 10 12,3
SOT23 = smd 1 x 1.4: 1 -0.95,-1.1; 2 0.95,-1.1; 3 0,1.1
R0603 = smd 1 x 1.1: 1 -0.85,0; 2 0.85,0
KMR621NGLFS = smd 1 x 1: 1 -2,-0.8; 2 2,-0.8; 3 -2,0.8; 4 2,0.8
TC2030-IDC-NL = smd 0.787 x 0.787: 1 1.27,-0.635; 2 1.27,0.635; 3 2.54,-0.635; 4 2.54,0.635; 5 3.81,-0.635; 6 3.81,0.635 | hole 0.889: 0,0; 5.08,-1.016; 5.08,1.016
LQFP-32 = smd 1.473 x 0.508: 1 -4.115,2.8; 2 -4.115,2; 3 -4.115,1.2; 4 -4.115,0.4; 5 -4.115,-0.4; 6 -4.115,-1.2; 7 -4.115,-2; 8 -4.115,-2.8; 17 4.115,-2.8; 18 4.115,-2; 19 4.115,-1.2; 20 4.115,-0.4; 21 4.115,0.4; 22 4.115,1.2; 23 4.115,2; 24 4.115,2.8 | smd 0.508 x 1.473: 9 -2.8,-4.115; 10 -2,-4.115; 11 -1.2,-4.115; 12 -0.4,-4.115; 13 0.4,-4.115; 14 1.2,-4.115; 15 2,-4.115; 16 2.8,-4.115; 25 2.8,4.115; 26 2,4.115; 27 1.2,4.115; 28 0.4,4.115; 29 -0.4,4.115; 30 -1.2,4.115; 31 -2,4.115; 32 -2.8,4.115
SOT230P700X180-4N = smd 1.626 x 0.889: 1 -3.2,2.311; 2 -3.2,0; 3 -3.2,-2.311 | smd 1.626 x 3.175: 4 3.2,0

### Placement (x,y rotation side)
C1  31.45,41.1 180 top
C2  41.95,38.6 0 top
C3  42.95,53.1 0 top
C4  44.45,6.1 180 top
C5  41.95,68.1 270 top
C6  43.45,61.6 0 top
C7  34.95,68.1 270 top
C8  31.45,67.1 90 top
C9  38.45,68.1 270 top
C10  46.45,66.6 0 top
C11  31.95,53.1 0 top
C12  36.95,75.6 180 top
C13  22.45,21.1 180 top
C14  65.95,17.1 90 top
C15  71.45,17.6 180 top
C16  76.95,17.1 270 top
C17  63.45,11.1 270 top
C18  80.95,11.6 90 top
C19  74.45,7.1 270 top
C20  70.95,9.6 0 top
CON1  73.45,73.6 0 top
CON2  105.3,65.85 270 top
D1  92.45,75.1 0 top
D2  94.95,75.1 0 top
D3  97.45,75.1 0 top
D4  99.95,75.1 0 top
D5  15.95,15.6 90 top
H1  6,44.45 0 top
H2  20,31.45 0 top
H3  46.45,31.45 0 top
H4  23.05,64.2 90 top
H5  60.5,64.2 90 top
HOLE1  102.24,51.7 0 top
HOLE2  50.09,51.4 0 top
HOLE3  100.89,19.5 0 top
HOLE4  48.74,19.2 0 top
HOLE5  26.25,74.45 0 top
HOLE6  107.14,57.36 0 top
HOLE7  3.75,3.75 0 top
HOLE8  3.75,26.25 0 top
HOLE9  84.64,74.45 0 top
HOLE10  107.14,74.45 0 top
HOLE11  107.14,26.25 0 top
HOLE12  3.75,57.36 0 top
HOLE13  51.64,11.25 0 top
HOLE14  51.64,59.25 0 top
HOLE15  84.64,3.75 0 top
HOLE16  26.25,3.75 0 top
IC1  41.95,74.6 180 top
IC2  53.45,74.1 0 top
IC3  15.95,21.1 180 top
IC4  71.45,13.6 180 top
J1  14.95,6.8 270 top
J2  40.95,19.1 180 top
J3  83.62,39.25 0 bottom
J4  24.45,41.1 90 top
J5  11.45,70.1 270 top
MOD1  75.49,35.45 90 top
Q1  95.45,60.1 0 top
Q2  99.95,60.1 0 top
R1  34.95,38.6 180 top
R2  38.45,38.1 90 top
R3  30.95,44.6 270 top
R4  46.45,69.6 0 top
R5  46.45,75.6 180 top
R6  46.45,72.6 180 top
R7  38.45,34.1 90 top
R8  72.45,67.1 180 top
R9  34.95,34.6 180 top
R10  77.95,67.1 180 top
R11  83.45,67.1 180 top
R12  88.95,67.1 180 top
R13  44.45,9.1 0 top
R14  44.45,12.1 180 top
R15  60.45,76.1 0 top
R16  64.95,74.1 180 top
R17  60.45,72.1 0 top
R18  22.45,18.1 0 top
R19  22.45,15.1 180 top
R20  65.95,10.1 90 top
R21  68.45,7.1 180 top
R22  77.45,10.1 180 top
R23  79.45,7.1 180 top
R24  97.95,56.1 180 top
R25  94.45,55.6 270 top
S1  50.95,3.6 0 top
SWD1  37.95,3.6 90 top
U1  38.95,46.1 90 top
U2  34.95,60.1 270 top

### Tracks (layer width: path | path; a pad name or v marks a point on that pad's centre or on a via)
12V  (via drill 0.35)
  Top 0.2: IC1.7 IC1.8 40.47,70.97 C5.1 C9.1 C7.1 v34.95,71.6 | R11.2 81.6,66.1 v80.45,66.1
  pour Bottom (isolate 0.254): -1.05,78.6 111.45,78.6 111.45,-0.4 -1.05,-0.4
+3V3  (via drill 0.35)
  Top 0.2: J1.1 21.05,4.93 24.38,8.26 28.12,8.26 30.22,6.16 31.5,6.16 v31.95,6.6 31.93,6.61 31.93,7.5 31.57,7.87 31.04,7.87 30.77,7.6 29.95,7.6 28.45,9.1 27.45,9.1 25.08,11.47 25.08,15.36 24.45,15.99 24.45,21.36 24.32,21.48 | IC3.3 20.96,21.73 C13.2 21.89,21.1 22.64,21.85 23.95,21.85 24.32,21.48 | C11.1 31,55.05 30.95,55.1 32.75,56.9 U2.4 | R15.1 59.5,76 57.95,76 | 57.95,76 IC2.8 55.35,76 54.75,75.4 54.75,71.76 54.08,71.1 49.45,71.1 48.45,70.1 48.45,62.2 46.85,60.6 37.45,60.6 34.95,63.1 | v63.45,71.6 67.95,67.1 R8.2 | v57.95,76.7 57.95,76 | U2.4 38.45,56.9 42.1,53.25 C3.1 41.75,52.75 U1.17 | 34.1,39.75 R1.2 34.39,38.6 35.19,37.8 37.29,37.8 R2.2 | 34.1,39.75 36.15,41.8 U1.1 36.15,43.8 41.75,49.4 U1.17 | 34.1,39.75 32.75,41.1 C1.1 32.3,37.95 25.45,31.1 25.45,27.15 24.59,26.29 24.59,21.75 24.32,21.48 | U2.2 34.95,63.1 | 34.95,63.1 U2.4 | U1.17 44.83,50.21 50.24,44.8 74.15,44.8 76.95,47.6 76.95,50.49 78.4,51.95 79.71,51.95 81.29,50.37 J3.6 89.95,48.6 89.95,43.6 88.18,41.83 J3.4 | SWD1.1 39.18,4.87 v39.95,4.1
  Bottom 0.2: v31.95,6.6 33.39,5.16 38.59,5.16 39.65,4.1 v39.95,4.1 | v63.45,71.6 58.34,76.7 v57.95,76.7
+5V  (via drill 0.35)
  Top 0.2: J4.4 29.45,57.98 29.45,61.6 31.15,63.3 32.45,63.3 | 32.45,63.3 U2.3 | C8.1 32.45,65.25 | 32.45,65.25 32.45,63.3 | C12.1 38.5,75 IC1.6 39.57,74.1 v39.45,74.1 | v42.45,76.7 43.35,75.8 IC1.4 44.39,75.8 44.99,76.4 46.49,76.4 R5.1 R6.1 47.3,71.01 48.1,70.2 48.1,64.2 C6.+ | v32.95,66.07 32.45,65.57 32.45,65.25 | R10.2 74.7,67.1 73.9,66.3 68.25,66.3 63.95,70.6 49.95,70.6 v49.45,70.1
  Bottom 0.2: v32.95,66.07 32.95,67.6 v39.45,74.1 42.05,76.7 v42.45,76.7 42.84,76.7 v49.45,70.1
+12V  (via drill 0.35)
  Top 0.2: R9.2 v32.45,34.6 | R12.2 87.1,66.1 v85.95,66.1 | IC4.11 67.3,14.35 C14.1 v65.95,13.6
  pour Route15 (isolate 0.254, rank 2): -1.05,78.6 111.45,78.6 111.45,-0.4 -1.05,-0.4
  pour Route15 (no thermals): 20.45,54.6 20.45,39.6 28.45,39.6 28.45,54.6
  pour Route15 (no thermals): 8.95,59.6 16.95,59.6 16.95,56.6 8.95,56.6
+24V  (via drill 0.35)
  Top 0.2: IC4.12 68.52,13.85 65.95,11.28 R20.2 64.4,12.5 C17.1 63.45,20.1 63.95,20.6 v84.45,20.6
  Bottom 0.2: v84.45,20.6 96.95,33.1 96.95,56.6 101.45,61.1 105.95,61.1 107.45,62.6 107.45,66.2 CON2.1
ANGLE_SENSOR  (via drill 0.35)
  Top 0.2: R13.1 R14.2 v28.45,12.1 | U1.6 40.15,43.3 v40.95,44.1
  Bottom 0.2: v40.95,44.1 36.45,44.1 33.45,47.1 32.95,47.1 29.8,43.95 29.8,35.56 24.95,30.71 24.95,16.1 28.45,12.6 v28.45,12.1
CAN_N  (via drill 0.35)
  Top 0.2: v29.09,37.46 28.88,37.25 13.45,37.25 11.67,35.47 11.67,21.77 11.71,21.73 IC3.6 15.81,21.73 16.9,20.64 D5.2
  Route15 0.2: J5.6 19.09,70.1 29.8,59.39 29.8,38.17 v29.09,37.46
CAN_P  (via drill 0.35)
  Top 0.2: v28.45,38.1 27.95,37.6 13.3,37.6 11.31,35.61 11.31,21.63 12.48,20.46 IC3.7 14.08,20.46 14.99,19.55 D5.1
  Route15 0.2: J5.1 11.8,69.75 13.18,69.75 13.18,69.57 13.92,68.83 14.97,68.83 15.71,69.57 15.71,69.75 18.95,69.75 29.45,59.25 29.45,39.1 v28.45,38.1
D  (via drill 0.35)
  Top 0.2: IC3.1 18.04,19.19 17.95,19.1 17.25,19.79 17.25,20.79 12.02,26.03 12.02,35.32 13.59,36.89 28.6,36.89 v28.95,36.55 | v35.95,53.6 37.75,51.8 U1.22
  Route15 0.2: v28.95,36.55 29.22,36.83 29.35,36.83 30.15,37.63 30.15,47.8 v35.95,53.6
DRIVER_EN  (via drill 0.35)
  Top 0.2: IC2.2 50.73,74.6 | 50.73,74.6 IC2.3 | U1.14 44.15,47.3 v44.45,47.6 | v53.95,74.6 50.73,74.6
  Route2 0.2: v44.45,47.6 44.45,48.21 41.43,51.22 41.43,54.01 41.3,54.14 41.3,56.45 54.44,69.6 54.45,69.6 54.45,73.1 53.95,73.6 v53.95,74.6
GND  (via drill 0.35)
  Top 0.2: D4.C D3.C D2.C D1.C 92.4,76.1 v89.95,76.1 | C4.2 46.9,2.8 S1.1 S1.2 | R13.2 45.3,7.8 C4.2 | SWD1.5 42.29,7.41 | 42.29,7.41 C4.2 | IC3.2 18.63,20.6 20.69,20.6 20.94,20.35 22.54,20.35 C13.1 23.3,19.45 22.75,18.9 22.69,18.9 22.45,18.66 22.45,15.95 R19.1 | D5.3 15.95,11.06 J1.MP2 | R19.1 19.08,10.88 J1.MP2 | J1.MP1 14.95,3.91 v14.95,4.1 | J1.MP2 15.95,10.7 v15.95,9.6 18.12,7.43 J1.5 | 42.29,7.41 41.6,8.1 v41.45,8.1 | IC2.5 58.09,72.19 58.99,71.3 60.2,71.3 61,72.1 R17.2 61.8,71.6 v62.45,71.6 | C9.2 C5.2 43.55,65.1 46.45,65.1 47.3,65.95 C10.2 R4.2 | C8.2 31.52,68.02 | 31.52,68.02 32.95,69.45 32.95,72.55 C12.2 37,76.6 38.65,76.6 39.45,75.8 IC1.5 41.4,74.87 IC1.9 IC1.10 | 31.52,68.02 32.85,66.7 C7.2 C9.2 | C2.2 42.8,37.6 R7.1 37.9,33.8 32.14,33.8 v31.95,33.6 | C1.2 30.6,43.4 R3.2 31.8,43.75 32.45,43.1 34.63,43.1 U1.32 34.83,42.48 v34.45,42.1 | 39.7,63.3 C6.- 43.14,61.6 44.09,62.55 44.9,62.55 v46.45,64.1 | 39.7,63.3 U2.1 | C9.2 38.45,64.55 39.7,63.3 | R19.1 v24.45,15.1 | C3.2 43.8,54.45 v43.95,54.6 | U1.16 44.25,48.9 v44.45,49.1 | C11.2 33.4,53.6 v34.45,53.6 | IC4.2 72.7,12.35 IC4.17 71.2,13.35 70.7,12.85 IC4.14
  Route2 0.2: v14.95,4.1 14.95,8.6 v15.95,9.6
  pour Route2 (isolate 0.254, rank 2): -1.05,78.6 111.45,78.6 111.45,-0.4 -1.05,-0.4
  pour Route2 (no thermals): 20.45,39.6 28.45,39.6 28.45,42.6 20.45,42.6
  pour Route2 (no thermals): 8.95,56.6 8.95,68.6 16.95,68.6 16.95,56.6
  pour Top (isolate 0.254, rank 2): -1.05,-0.4 111.45,-0.4 111.45,78.6 -1.05,78.6
GNDA  (via drill 0.35)
  Top 0.2: IC4.5 80.1,13.85 C18.2 | R23.1 80.3,8.25 79.45,9.1 79.45,11.5 C18.2 | Q2.2 99.8,60.1 97.5,60.1 Q1.2 96.45,58.95 v96.45,57.6 | C18.2 80.95,17.6 v81.45,18.1
  Bottom 0.2: v81.45,18.1 81.45,18.6 84.45,21.6 84.95,21.6 96.59,33.25 96.59,57.45 v96.45,57.6
INPUT_1
  Top 0.2: U1.11 44.15,44.9 44.59,44.45 74.3,44.45 78.95,49.1 79.06,49.21 J3.7
INPUT_2
  Top 0.2: U1.10 86.36,44.1 J3.5
LEFT_STEP  (via drill 0.35)
  Top 0.2: U1.29 36.05,45.7 v36.95,46.6 | v56.95,51.6 59.95,51.6 61.95,53.6 96.3,53.6 R24.1 98.8,58.8 Q2.1
  Route2 0.2: v36.95,46.6 51.95,46.6 v56.95,51.6
MOTOR_A1
  Route15 3.2: J2.3 32.95,19.18 32.95,24.1 45.87,37.03 J3.10
  Bottom 3.2: J2.3 32.95,19.18 32.95,24.1 45.87,37.03 J3.10
MOTOR_A2
  Route15 3.2: J2.4 28.95,19.22 28.95,26.6 43.82,41.48 J3.9
  Bottom 3.2: J2.4 28.95,19.22 28.95,26.6 43.82,41.48 J3.9
MOTOR_B1
  Route15 3.2: J2.1 49.98,28.14 J3.12
  Bottom 3.2: J2.1 49.98,28.14 J3.12
MOTOR_B2
  Route15 3.2: J2.2 36.95,19.14 36.95,21.6 47.93,32.58 J3.11
  Bottom 3.2: J2.2 36.95,19.14 36.95,21.6 47.93,32.58 J3.11
N$1
  Top 0.2: CON1.3 74.8,73.6 73.84,74.55 70.4,74.55 68.95,73.1 66.8,73.1 R16.1 63.8,76.1 R15.2 59.93,74.73 IC2.7
N$2
  Top 0.2: R14.1 48.3,15.1 50.14,15.1 60.68,25.64 80.18,25.64 82.68,28.14 J3.1
N$3
  Top 0.2: CON1.2 72.3,73.6 71.34,72.64 65.55,72.64 R16.2 62.9,72.9 60.69,72.9 59.96,72.17 59.52,72.17 | R17.1 59.52,72.17 | 59.52,72.17 58.23,73.46 IC2.6
N$4
  Top 0.2: R12.1 93,67.1 D4.A
N$5
  Top 0.2: IC1.2 45.02,72.6 R6.2 R4.1
N$6
  Top 0.2: C10.1 43.42,68.77 IC1.1
N$7
  Top 0.2: C15.2 69.45,17.6 67.95,16.1 67.95,15.1 68.2,14.85 IC4.10
N$8
  Top 0.2: C15.1 73.45,17.6 74.95,16.1 74.95,15.1 74.7,14.85 IC4.7
N$9
  Top 0.2: C20.1 70.1,10.99 IC4.16
N$10
  Top 0.2: R11.1 86.69,67.1 87.49,67.9 93.25,67.9 97.45,72.1 D3.A
N$11
  Top 0.2: IC1.3 45,75 R5.2
N$12
  Top 0.2: C19.1 74.45,9.6 75.95,11.1 75.95,12.6 75.7,12.85 IC4.3
N$13
  Top 0.2: IC4.6 75.6,14.35 C16.2
N$14
  Top 0.2: R21.2 65.95,8.75 65.95,9.1 | 65.95,9.1 R20.1 | 65.95,9.1 68.08,11.23 68.08,11.91 68.52,12.35 IC4.15
N$15  (via drill 0.35)
  Top 0.2: R19.2 R18.1 v19.95,18.1 | IC3.8 13.45,19.14 v13.45,18.1
  Bottom 0.2: v13.45,18.1 v19.95,18.1
N$16
  Top 0.2: IC4.4 77.7,13.35 78.45,12.6 78.45,10.25 R22.1 78.6,9.8 R23.2
N$17
  Top 0.2: R10.1 81.19,67.1 82.34,68.25 93.1,68.25 94.95,70.1 D2.A
N$18
  Top 0.2: Q1.3 97.35,63.1 100.45,63.1 103.2,65.85 CON2.2
N$19
  Top 0.2: CON2.3 102.1,63.35 Q2.3
N$26
  Top 0.2: R1.1 36.45,38.6 37.55,39.7 38.95,39.7 39.35,40.1 39.35,40.35 | 39.35,40.35 U1.5 | C2.1 39.35,40.35
N$27
  Top 0.2: R3.1 32.3,44.1 U1.31
N$42
  Top 0.2: R8.1 74.8,68.61 91.45,68.61 92.45,69.6 D1.A
NRST  (via drill 0.35)
  Top 0.2: 20.03,6.18 21.8,6.18 24.24,8.61 28.26,8.61 30.11,6.76 30.83,6.76 v31.3,7.24 | SWD1.3 39.62,5.1 v39.95,5.1 44.1,5.1 47.15,2.05 53.55,2.05 53.7,2.19 53.7,3.4 52.95,4.16 S1.4 S1.3 46.95,4.4 45.3,6.05 C4.1 | R2.1 34.6,37.25 v34.45,37.1 | v37.95,40.6 38.55,41.2 U1.4 | v30.09,32.46 29.3,32.46 29.09,32.25 28.59,32.25 26.86,30.51 26.86,26.51 26,25.66 26,18.43 26.58,17.86 26.58,17.23 26.13,16.79 26.13,14.42 26.69,13.86 26.69,12.34 v25.95,11.6 | v21.45,7.6 20.03,6.18 | 20.03,6.18 J1.3
  Route2 0.2: v25.95,11.6 25.45,11.1 24.95,11.1 v21.45,7.6
  Route15 0.2: v37.95,40.6 v34.45,37.1 33.95,37.1 30.45,33.6 30.45,32.81 v30.09,32.46
  Bottom 0.2: v31.3,7.24 32.3,7.24 34.03,5.51 38.74,5.51 39.15,5.1 v39.95,5.1
R  (via drill 0.35)
  Top 0.2: IC3.4 15.54,23 12.45,26.1 12.45,35.25 13.72,36.52 27.52,36.52 v27.95,36.1 | v37.64,52.79 38.55,51.89 U1.21
  Route15 0.2: v37.64,52.79 35.64,52.79 30.5,47.66 30.5,37.16 28.95,35.6 28.45,35.6 v27.95,36.1
RIGHT_STEP  (via drill 0.35)
  Top 0.2: U1.30 36.25,44.9 v36.95,45.6 | v60.95,54.1 92.1,54.1 R25.1 94.5,56.5 Q1.1
  Route2 0.2: v36.95,45.6 52.45,45.6 v60.95,54.1
RS  (via drill 0.35)
  Top 0.2: U1.3 37.45,41.69 37.45,41.14 37.31,40.99 36.84,40.99 v36.45,40.6 | v29.45,33.1 28.95,32.6 28.45,32.6 26.51,30.66 26.51,26.66 25.65,25.8 25.65,21.31 25.5,21.16 25.5,18.04 v25.95,17.6 | v23.45,16.6 23.3,16.75 R18.2
  Route2 0.2: v25.95,17.6 24.95,16.6 v23.45,16.6
  Route15 0.2: v36.45,40.6 36.45,40.1 v29.45,33.1
RX1  (via drill 0.35)
  Top 0.2: U1.20 39.35,52.5 v39.45,52.6 | v52.95,75.6 52.54,76 IC2.1
  Route2 0.2: v39.45,52.6 39.82,52.97 40.71,52.97 41.08,53.34 41.08,53.86 40.95,53.99 40.95,56.6 54.08,69.73 54.08,72.97 52.95,74.1 v52.95,75.6
RX2  (via drill 0.35)
  Top 0.2: U1.25 33.95,49.78 v33.95,50.1 | v29.95,34.6 29.45,34.1 28.95,34.1 25.8,30.96 25.8,27 24.95,26.14 24.95,21.6 24.8,21.45 24.8,16.14 25.43,15.51 25.43,13.12 25.71,12.84 v25.71,12.6 | v20.45,8.6 18.54,8.6 J1.7
  Route2 0.2: v25.71,12.6 21.71,8.6 v20.45,8.6
  Route15 0.2: v33.95,50.1 33.45,49.6 32.95,49.6 30.95,47.6 30.95,35.6 v29.95,34.6
STM_12_INDIC  (via drill 0.35)
  Top 0.2: R9.1 35.87,34.67 | 35.87,34.67 36.15,34.95 R7.2 | U1.7 40.65,41.69 40.65,41.14 40.51,40.99 40.26,40.99 v39.98,40.72 | v31.45,32.6 31.45,33.21 31.32,33.34 31.32,34.36 32.36,35.4 34.7,35.4 35.43,34.67 35.87,34.67
  Bottom 0.2: v39.98,40.72 31.86,32.6 v31.45,32.6
SWDCLK  (via drill 0.35)
  Top 0.2: J1.4 11.45,6.18 | 11.45,6.18 14.65,6.18 16.98,3.85 20.97,3.85 24.67,7.55 27.83,7.55 29.93,5.45 36.62,5.45 SWD1.4 | U1.24 36.15,48.65 v36.1,48.6 | v18.45,38.6 18.15,38.3 13.01,38.3 10.61,35.9 10.61,10.27 9.67,9.33 9.67,6.88 10.45,6.1 11.37,6.1 11.45,6.18
  Bottom 0.2: v18.45,38.6 18.92,38.6 19.19,38.86 19.71,38.86 20.12,38.45 27.3,38.45 29.09,40.25 29.09,44.24 32.82,47.97 32.82,48.36 33.19,48.73 33.71,48.73 33.84,48.6 v36.1,48.6
SWDIO  (via drill 0.35)
  Top 0.2: U1.23 v36.95,51.6 | v17.54,38.93 17.26,38.66 12.86,38.66 10.26,36.05 10.26,10.42 9.32,9.48 9.32,6.23 10.62,4.93 J1.2 15.41,4.93 16.84,3.5 21.12,3.5 24.82,7.2 27.68,7.2 29.78,5.1 37.08,5.1 37.16,5.02 SWD1.2
  Bottom 0.2: v17.54,38.93 17.83,39.23 19.84,39.23 20.26,38.8 27.15,38.8 28.74,40.39 28.74,44.39 32.46,48.11 32.46,48.51 33.04,49.08 33.85,49.08 33.98,48.95 34.3,48.95 v36.95,51.6
SWO  (via drill 0.35)
  Top 0.2: U1.26 v33.45,48.1 | v19.45,38.23 19.17,37.95 13.15,37.95 10.96,35.76 10.96,10.12 10.02,9.18 10.02,8.02 10.62,7.43 J1.6 13.9,7.43 17.12,4.21 20.83,4.21 24.53,7.91 27.97,7.91 30.08,5.8 35.71,5.8 SWD1.6
  Bottom 0.2: v33.45,48.1 29.45,44.1 29.45,40.1 27.45,38.1 19.45,38.1 v19.45,38.23
TX1  (via drill 0.35)
  Top 0.2: U1.19 40.15,53.3 v40.45,53.6 | v53.45,72.6 53.04,72.19 IC2.4
  Route2 0.2: v40.45,53.6 40.45,56.6 53.45,69.6 v53.45,72.6
TX2  (via drill 0.35)
  Top 0.2: J1.8 12.87,8.68 v12.95,8.6 | v26.06,13.6 25.78,13.88 25.78,15.65 25.15,16.28 25.15,21.3 25.3,21.45 25.3,25.95 26.16,26.81 26.16,30.81 29.09,33.75 29.99,33.75 30.58,34.34 30.58,34.73 31.95,36.1 40,36.1 41.9,37.99 41.9,39.2 41.75,39.36 U1.8
  Route2 0.2: v12.95,8.6 14.95,10.6 22.95,10.6 25.08,12.73 25.08,12.86 25.45,13.23 25.69,13.23 v26.06,13.6

### Text on the board
tPlace: DB | 3.3V | 5V | 12V | EXT_MODE | NCU | R_NCU | CCU - NCU / Rev2, 21.03.04